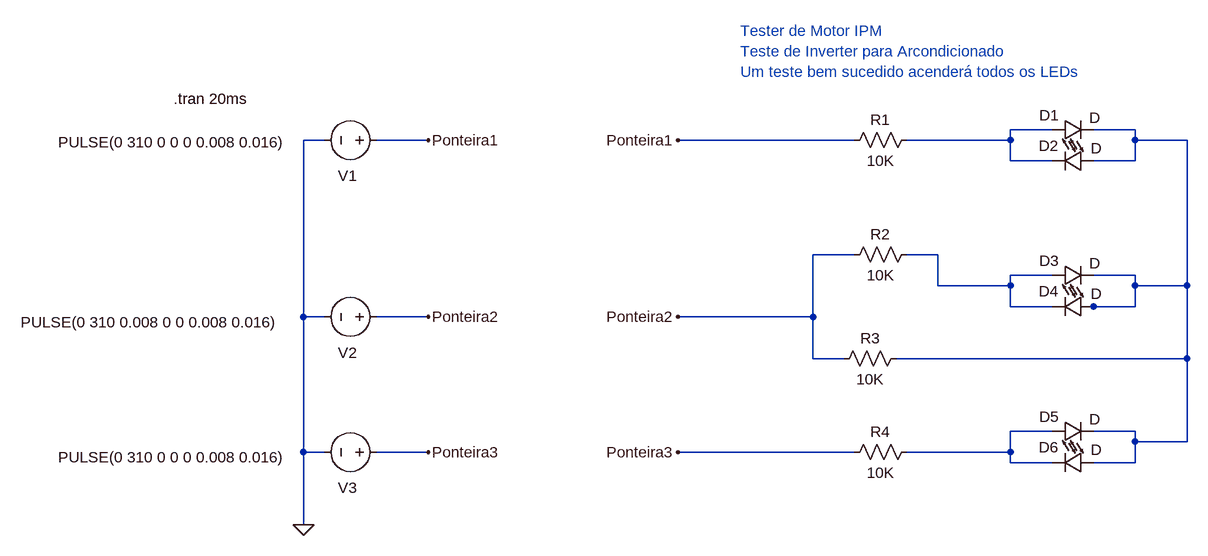
[diagram p0: schematic motor-ipm-tester.asc]
motor-ipm-tester.asc, the LTspice schematic file:
Version 4
SHEET 1 888 680
WIRE 608 -112 544 -112
WIRE 736 -112 672 -112
WIRE -512 -96 -544 -96
WIRE -352 -96 -432 -96
WIRE 304 -96 32 -96
WIRE 544 -96 544 -112
WIRE 544 -96 384 -96
WIRE 736 -96 736 -112
WIRE 816 -96 736 -96
WIRE 544 -64 544 -96
WIRE 608 -64 544 -64
WIRE 736 -64 736 -96
WIRE 736 -64 672 -64
WIRE 304 80 240 80
WIRE 432 80 384 80
WIRE 608 112 544 112
WIRE 736 112 672 112
WIRE 432 128 432 80
WIRE 544 128 544 112
WIRE 544 128 432 128
WIRE 736 128 736 112
WIRE 816 128 816 -96
WIRE 816 128 736 128
WIRE 544 160 544 128
WIRE 608 160 544 160
WIRE 672 160 656 160
WIRE 736 160 736 128
WIRE 736 160 672 160
WIRE -544 176 -544 -96
WIRE -512 176 -544 176
WIRE -352 176 -432 176
WIRE 240 176 240 80
WIRE 240 176 32 176
WIRE 240 240 240 176
WIRE 288 240 240 240
WIRE 816 240 816 128
WIRE 816 240 368 240
WIRE 608 352 544 352
WIRE 736 352 672 352
WIRE 736 368 736 352
WIRE 816 368 816 240
WIRE 816 368 736 368
WIRE -544 384 -544 176
WIRE -512 384 -544 384
WIRE -352 384 -432 384
WIRE 304 384 32 384
WIRE 544 384 544 352
WIRE 544 384 384 384
WIRE 544 400 544 384
WIRE 608 400 544 400
WIRE 736 400 736 368
WIRE 736 400 672 400
WIRE -544 496 -544 384
FLAG -544 496 0
FLAG -352 -96 Ponteira1
FLAG 32 -96 Ponteira1
FLAG -352 176 Ponteira2
FLAG 32 176 Ponteira2
FLAG -352 384 Ponteira3
FLAG 32 384 Ponteira3
SYMBOL voltage -416 -96 R90
WINDOW 0 55 46 VRight 2
WINDOW 3 3 155 VRight 2
WINDOW 123 0 0 Left 0
WINDOW 39 0 0 Left 0
SYMATTR InstName V1
SYMATTR Value PULSE(0 310 0 0 0 0.008 0.016)
SYMBOL res 400 -112 R90
WINDOW 0 0 56 VBottom 2
WINDOW 3 32 56 VTop 2
SYMATTR InstName R1
SYMATTR Value 10K
SYMBOL res 400 64 R90
WINDOW 0 0 56 VBottom 2
WINDOW 3 32 56 VTop 2
SYMATTR InstName R2
SYMATTR Value 10K
SYMBOL res 384 224 R90
WINDOW 0 0 56 VBottom 2
WINDOW 3 32 56 VTop 2
SYMATTR InstName R3
SYMATTR Value 10K
SYMBOL res 400 368 R90
WINDOW 0 0 56 VBottom 2
WINDOW 3 32 56 VTop 2
SYMATTR InstName R4
SYMATTR Value 10K
SYMBOL LED 608 -96 R270
WINDOW 0 23 -4 VTop 2
WINDOW 3 50 66 VBottom 2
SYMATTR InstName D1
SYMBOL LED 672 -80 R90
WINDOW 0 8 69 VBottom 2
WINDOW 3 -19 -4 VTop 2
SYMATTR InstName D2
SYMBOL LED 608 128 R270
WINDOW 0 23 -4 VTop 2
WINDOW 3 50 66 VBottom 2
SYMATTR InstName D3
SYMBOL LED 672 144 R90
WINDOW 0 8 69 VBottom 2
WINDOW 3 -19 -4 VTop 2
SYMATTR InstName D4
SYMBOL LED 608 368 R270
WINDOW 0 23 -4 VTop 2
WINDOW 3 50 66 VBottom 2
SYMATTR InstName D5
SYMBOL LED 672 384 R90
WINDOW 0 8 69 VBottom 2
WINDOW 3 -19 -4 VTop 2
SYMATTR InstName D6
SYMBOL voltage -416 176 R90
WINDOW 0 55 46 VRight 2
WINDOW 3 8 165 VRight 2
WINDOW 123 0 0 Left 0
WINDOW 39 0 0 Left 0
SYMATTR InstName V2
SYMATTR Value PULSE(0 310 0.008 0 0 0.008 0.016)
SYMBOL voltage -416 384 R90
WINDOW 0 55 46 VRight 2
WINDOW 3 8 155 VRight 2
WINDOW 123 0 0 Left 0
WINDOW 39 0 0 Left 0
SYMATTR InstName V3
SYMATTR Value PULSE(0 310 0 0 0 0.008 0.016)
TEXT 128 -264 Left 2 ;Tester de Motor IPM\nTeste de Inverter para Arcondicionado\nUm teste bem sucedido acenderá todos os LEDs
TEXT -744 -160 Left 2 !.tran 20ms

The netlist it stands for:
* motor-ipm-tester.asc
V1 Ponteira1 0 PULSE(0 310 0 0 0 0.008 0.016)
R1 N001 Ponteira1 10K
R2 N003 Ponteira2 10K
R3 N002 Ponteira2 10K
R4 N004 Ponteira3 10K
D1 N001 N002 D
D2 N002 N001 D
D3 N003 N002 D
D4 N002 N003 D
D5 N004 N002 D
D6 N002 N004 D
V2 Ponteira2 0 PULSE(0 310 0.008 0 0 0.008 0.016)
V3 Ponteira3 0 PULSE(0 310 0 0 0 0.008 0.016)
.model D D
.lib standard.dio
* Tester de Motor IPM
* Teste de Inverter para Arcondicionado
* Um teste bem sucedido acenderá todos os LEDs
.tran 20ms
.backanno
.end

* Results of the author's LTspice run, read from the files saved beside the schematic
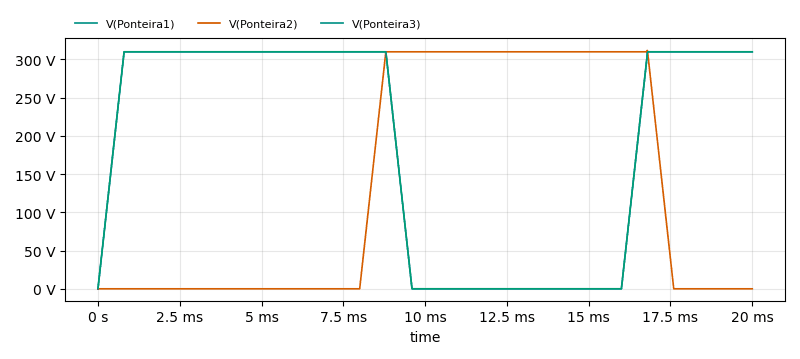
[diagram p1: Transient Analysis of motor-ipm-tester.asc, plotted from the saved traces]
* Transient Analysis, 1 run:
*   V(Ponteira1): min 0 V, max 310 V, average 192.2 V, rms 243.5 V, last 310 V
*   V(Ponteira2): min 0 V, max 311.9 V, average 136.4 V, rms 205.2 V, last 0 V
*   V(Ponteira3): min 0 V, max 310 V, average 192.2 V, rms 243.5 V, last 310 V